# EasyEDA schematic 3 Antenna Mini-Whip (TH)_ Main module.json
TITLE: Antenna Mini-Whip (TH): Main module; REV: 2.5.EE; Date: 2018-03-02; Sheet: 1/1; Drawn By: IgrikXD
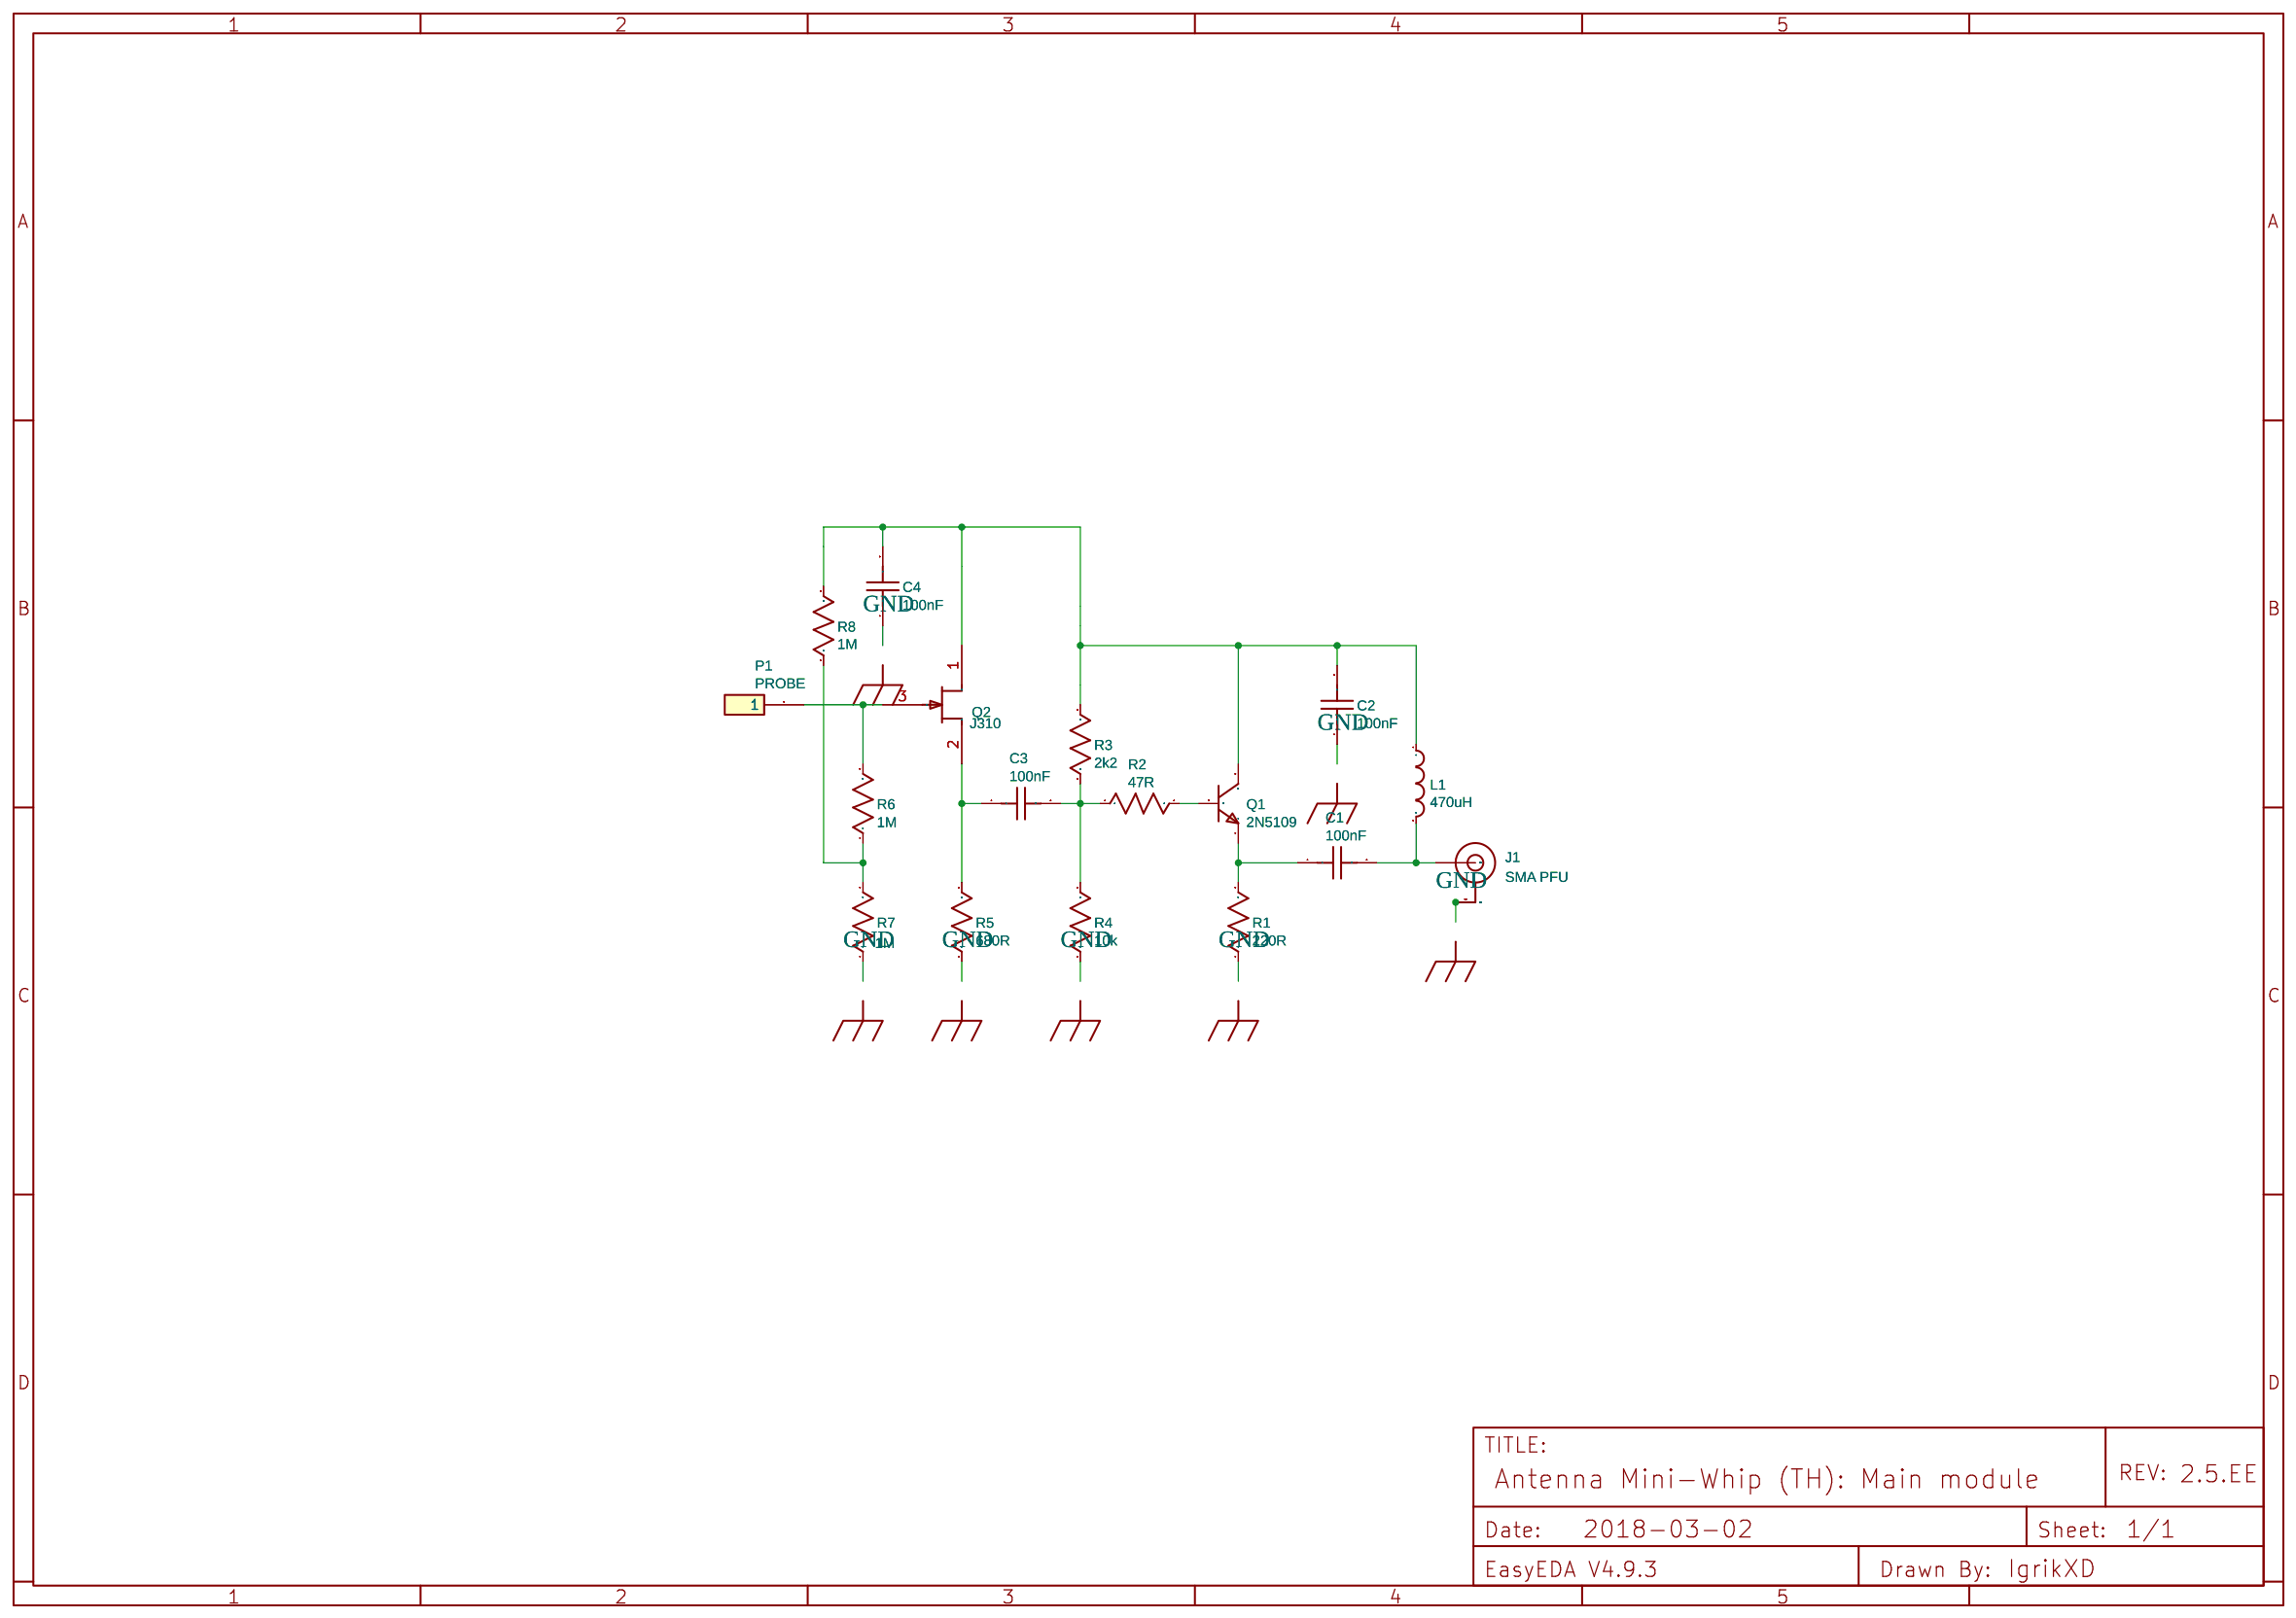
[diagram p0: schematic sheet]

## Parts
C1  100nF  [RAD-0.1]
C2  100nF  [RAD-0.1]
C3  100nF  [RAD-0.1]
C4  100nF  [RAD-0.1]
J1  SMA PFU  [SMA-EDGE]
L1  470uH  [AXIAL-0.4]
P1  PROBE  [HDR-1X1/2.54]
Q1  2N5109  [TO39]
Q2  J310  [TO92-INLINE]
R1  220R  [AXIAL-0.3]
R2  47R  [AXIAL-0.3]
R3  2k2  [AXIAL-0.3]
R4  10k  [AXIAL-0.3]
R5  680R  [AXIAL-0.3]
R6  1M  [AXIAL-0.3]
R7  1M  [AXIAL-0.3]
R8  1M  [AXIAL-0.3]

## Library data of the parts
C1-C4 = Capacitor: Manufacturer Part: Monolithic0805B104J500F3; Supplier: LCSC; LCSC: C110282; Manufacturer: FH
J1 = -: SMA Antenna Connector; catid: 20; Contributor: Pinoccio; Manufacturer Part: CON-SMA-EDGE-S; Supplier: Digi-Key; Digi-Key: CON-SMA-EDGE-S-ND; Manufacturer: RF Solutions
L1 = Inductor: Manufacturer Part: LGA0510-471KP52E; Supplier: LCSC; LCSC: C72362; Manufacturer: FH
P1 = -: LCSC: C81276; Supplier: LCSC; Manufacturer: LCSC; Manufacturer Part: Header-Male-2.54_1x1; Mounted: No
Q1 = -: NPN General Purpose Amplifier; catid: 20; Supplier: Digi-Key; Digi-Key: 2N5109CS-ND; Manufacturer: Central Semiconductor Corp
Q2 = -: catid: 20; Supplier: Digi-Key; Manufacturer: ON Semiconductor; Digi-Key: J310-ND
R1 = Resistor: Manufacturer Part: MFR0W4F2200A50; Supplier: LCSC; LCSC: C57439; Manufacturer: UniOhm
R2 = Resistor: Manufacturer Part: MF1/4W-47Ω±1% T52; Supplier: LCSC; LCSC: C119296; Manufacturer: CCO
R3 = Resistor: Manufacturer Part: MFR0W4F2201A50; Supplier: LCSC; LCSC: C58595; Manufacturer: UniOhm
R4 = Resistor: Manufacturer Part: MFR0W4F1002A50; Supplier: LCSC; LCSC: C57436; Manufacturer: UniOhm
R5 = Resistor: Manufacturer Part: MFR0W4F6800A50; Supplier: LCSC; LCSC: C58599; Manufacturer: UniOhm
R6-R8 = Resistor: Manufacturer Part: MFR0W4F1004A50; Supplier: LCSC; LCSC: C58596; Manufacturer: UniOhm

## Nets
GND: C2.1 C4.1 J1.GND@0(GND) J1.GND@1(GND) J1.GND@2(GND) J1.GND@3(GND) R1.1 R4.1 R5.1 R7.1
Net-(C1-1): C1.1 Q1.1(E) R1.2
Net-(C1-2): C1.2 J1.SIG(SIGNAL) L1.2
Net-(C2-2): C2.2 C4.2 L1.1 Q1.3(C) Q2.1(D) R3.2 R8.2
Net-(C3-1): C3.1 Q2.2(S) R5.2
Net-(C3-2): C3.2 R2.1 R3.1 R4.2
Net-(P1-1): P1.1 Q2.3(G) R6.2
Net-(Q1-2): Q1.2(B) R2.2
Net-(R6-1): R6.1 R7.2 R8.1
